# EAGLE schematic arduinoBaseboard (EAGLE 6.5.0)
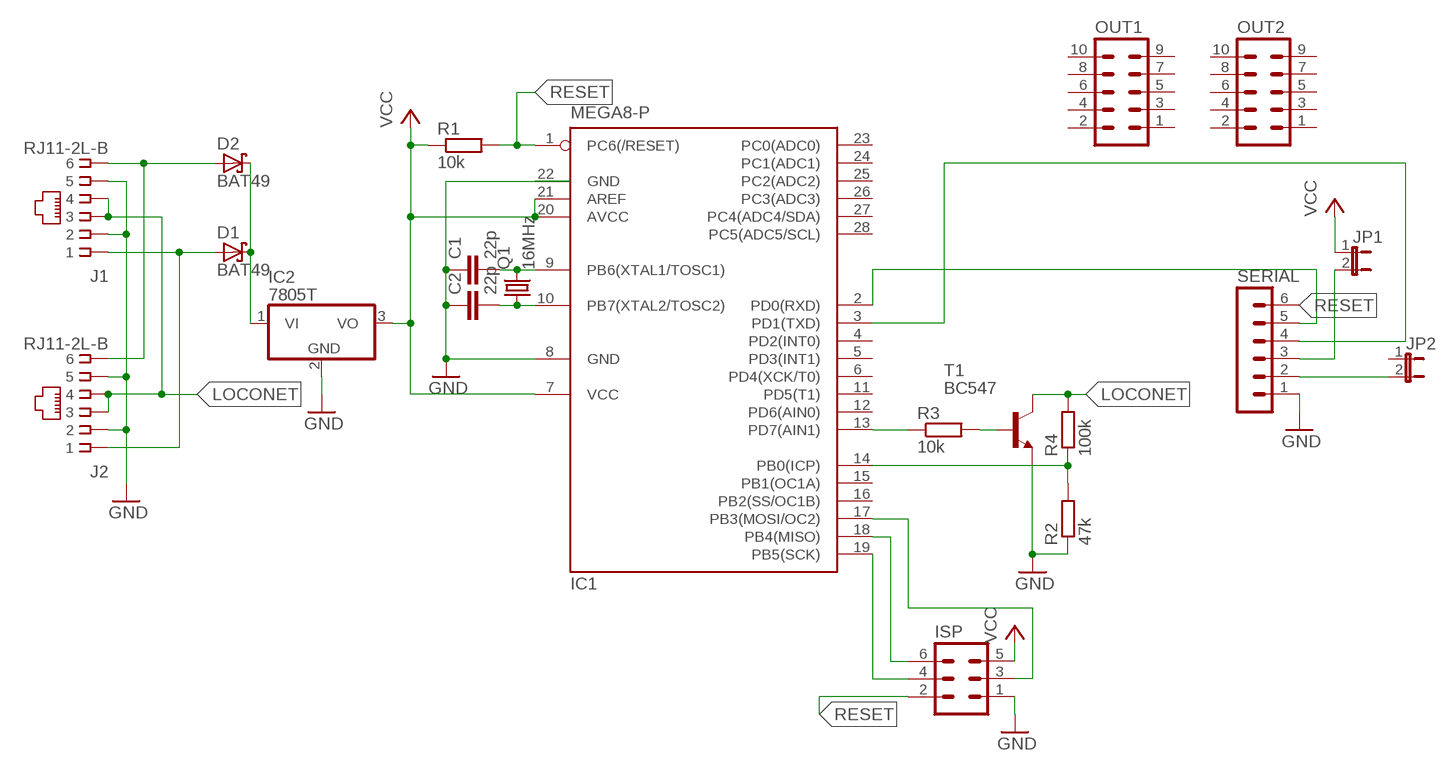
[diagram p0: schematic, sheet 1]

## Parts
C1  22p  C-EU025-024X044  [C025-024X044]
C2  22p  C-EU025-024X044  [C025-024X044]
D1  BAT49  [DO41-10]
D2  BAT49  [DO41-10]
IC1  MEGA8-P  [DIL28-3]
IC2  7805T  [TO220H]
ISP  MA03-2  [MA03-2]
J1  RJ11-2L-B  [RJ11-NO_SHIELD]
J2  RJ11-2L-B  [RJ11-NO_SHIELD]
JP1  JP1E  [JP1]
JP2  JP1E  [JP1]
OUT1  MA05-2  [MA05-2]
OUT2  MA05-2  [MA05-2]
Q1  16MHz  CRYSTALHC49S  [HC49/S]
R1  10k  R-EU_0204/7  [0204/7]
R2  47k  R-EU_0204/7  [0204/7]
R3  10k  R-EU_0204/7  [0204/7]
R4  100k  R-EU_0204/7  [0204/7]
SERIAL  MA06-1  [MA06-1]
T1  BC547  [TO92]

## Nets
GND: C1.1 C2.1 IC1.8(GND) IC1.22(GND) IC2.2(GND) ISP.1 J1.2 J1.5 J2.2 J2.5 R2.1 SERIAL.1 T1.1(E)
LOCONET: J1.3 J1.4 J2.3 J2.4 R4.2 T1.3(C)
N$1: IC1.14(PB0(ICP)) R2.2 R4.1
N$2: D1.C D2.C IC2.1(VI)
N$3: D2.A J1.6 J2.6
N$4: D1.A J1.1 J2.1
N$5: C2.2 IC1.10(PB7(XTAL2/TOSC2)) Q1.1
N$6: C1.2 IC1.9(PB6(XTAL1/TOSC1)) Q1.2
N$7: IC1.19(PB5(SCK)) ISP.4
N$8: IC1.17(PB3(MOSI/OC2)) ISP.3
N$9: IC1.13(PD7(AIN1)) R3.1
N$10: R3.2 T1.2(B)
N$11: IC1.18(PB4(MISO)) ISP.6
N$12: IC1.2(PD0(RXD)) SERIAL.5
N$13: JP2.2 SERIAL.2
N$14: IC1.3(PD1(TXD)) SERIAL.4
RESET: IC1.1(PC6(/RESET)) ISP.2 JP1.2 R1.2 SERIAL.3
VCC: IC1.7(VCC) IC1.20(AVCC) IC1.21(AREF) IC2.3(VO) ISP.5 JP1.1 R1.1
Unconnected: IC1.4(PD2(INT0)) IC1.5(PD3(INT1)) IC1.6(PD4(XCK/T0)) IC1.11(PD5(T1)) IC1.12(PD6(AIN0)) IC1.15(PB1(OC1A)) IC1.16(PB2(SS/OC1B)) IC1.23(PC0(ADC0)) IC1.24(PC1(ADC1)) IC1.25(PC2(ADC2)) IC1.26(PC3(ADC3)) IC1.27(PC4(ADC4/SDA)) IC1.28(PC5(ADC5/SCL)) JP2.1 OUT1.1 OUT1.2 OUT1.3 OUT1.4 OUT1.5 OUT1.6 OUT1.7 OUT1.8 OUT1.9 OUT1.10 OUT2.1 OUT2.2 OUT2.3 OUT2.4 OUT2.5 OUT2.6 OUT2.7 OUT2.8 OUT2.9 OUT2.10 SERIAL.6

## Library data of the parts
C1 C2 = resistor:C-EU: CAPACITOR, European symbol
D1 D2 = diode:BAT49: DIODE small signal diode
IC1 = atmel:MEGA8-P: MICROCONTROLLER 8 Kbytes FLASH, 1 kbytes SRAM, 512 bytes EEPROM, USART, 4-channel 10 bit ADC, 2-channel 8 bit ADC Pin compatible with Atmega48, ATMega88, ATMega168 Source: avr.lbr; OC_FARNELL: unknown; OC_NEWARK: unknown
IC2 = linear:78*: Positive VOLTAGE REGULATOR Source: http://cache.national.com/ds/LM/LM78L05.pdf http://www.fairchildsemi.com/ds/LM/LM7805.pdf
ISP = con-lstb:MA03-2: PIN HEADER; OC_FARNELL: unknown; OC_NEWARK: unknown
J1 J2 = con-tycoelectronics:RJ11: CORCOM Modular RJ Jacks No Shield Source: www.tycoelectronics.com .. ENG_DS_1654001_1099_RJ_L_0507.pdf; MF: TYCO ELECTRONICS; MPN: RJ11-2L-B; OC_FARNELL: unknown; OC_NEWARK: 83F4463
JP1 JP2 = jumper:JP1E: JUMPER
OUT1 OUT2 = con-lstb:MA05-2: PIN HEADER; OC_FARNELL: unknown; OC_NEWARK: unknown
Q1 = crystal:CRYSTAL: CRYSTAL; OC_FARNELL: 1667008; OC_NEWARK: unknown
R1-R4 = resistor:R-EU_: RESISTOR, European symbol
SERIAL = con-lstb:MA06-1: PIN HEADER; OC_FARNELL: unknown; OC_NEWARK: unknown
T1 = transistor-neu-to92:BC547: NPN TRANSISTOR